# EAGLE design FLC100_shield_v1.0 (EAGLE 6.2)
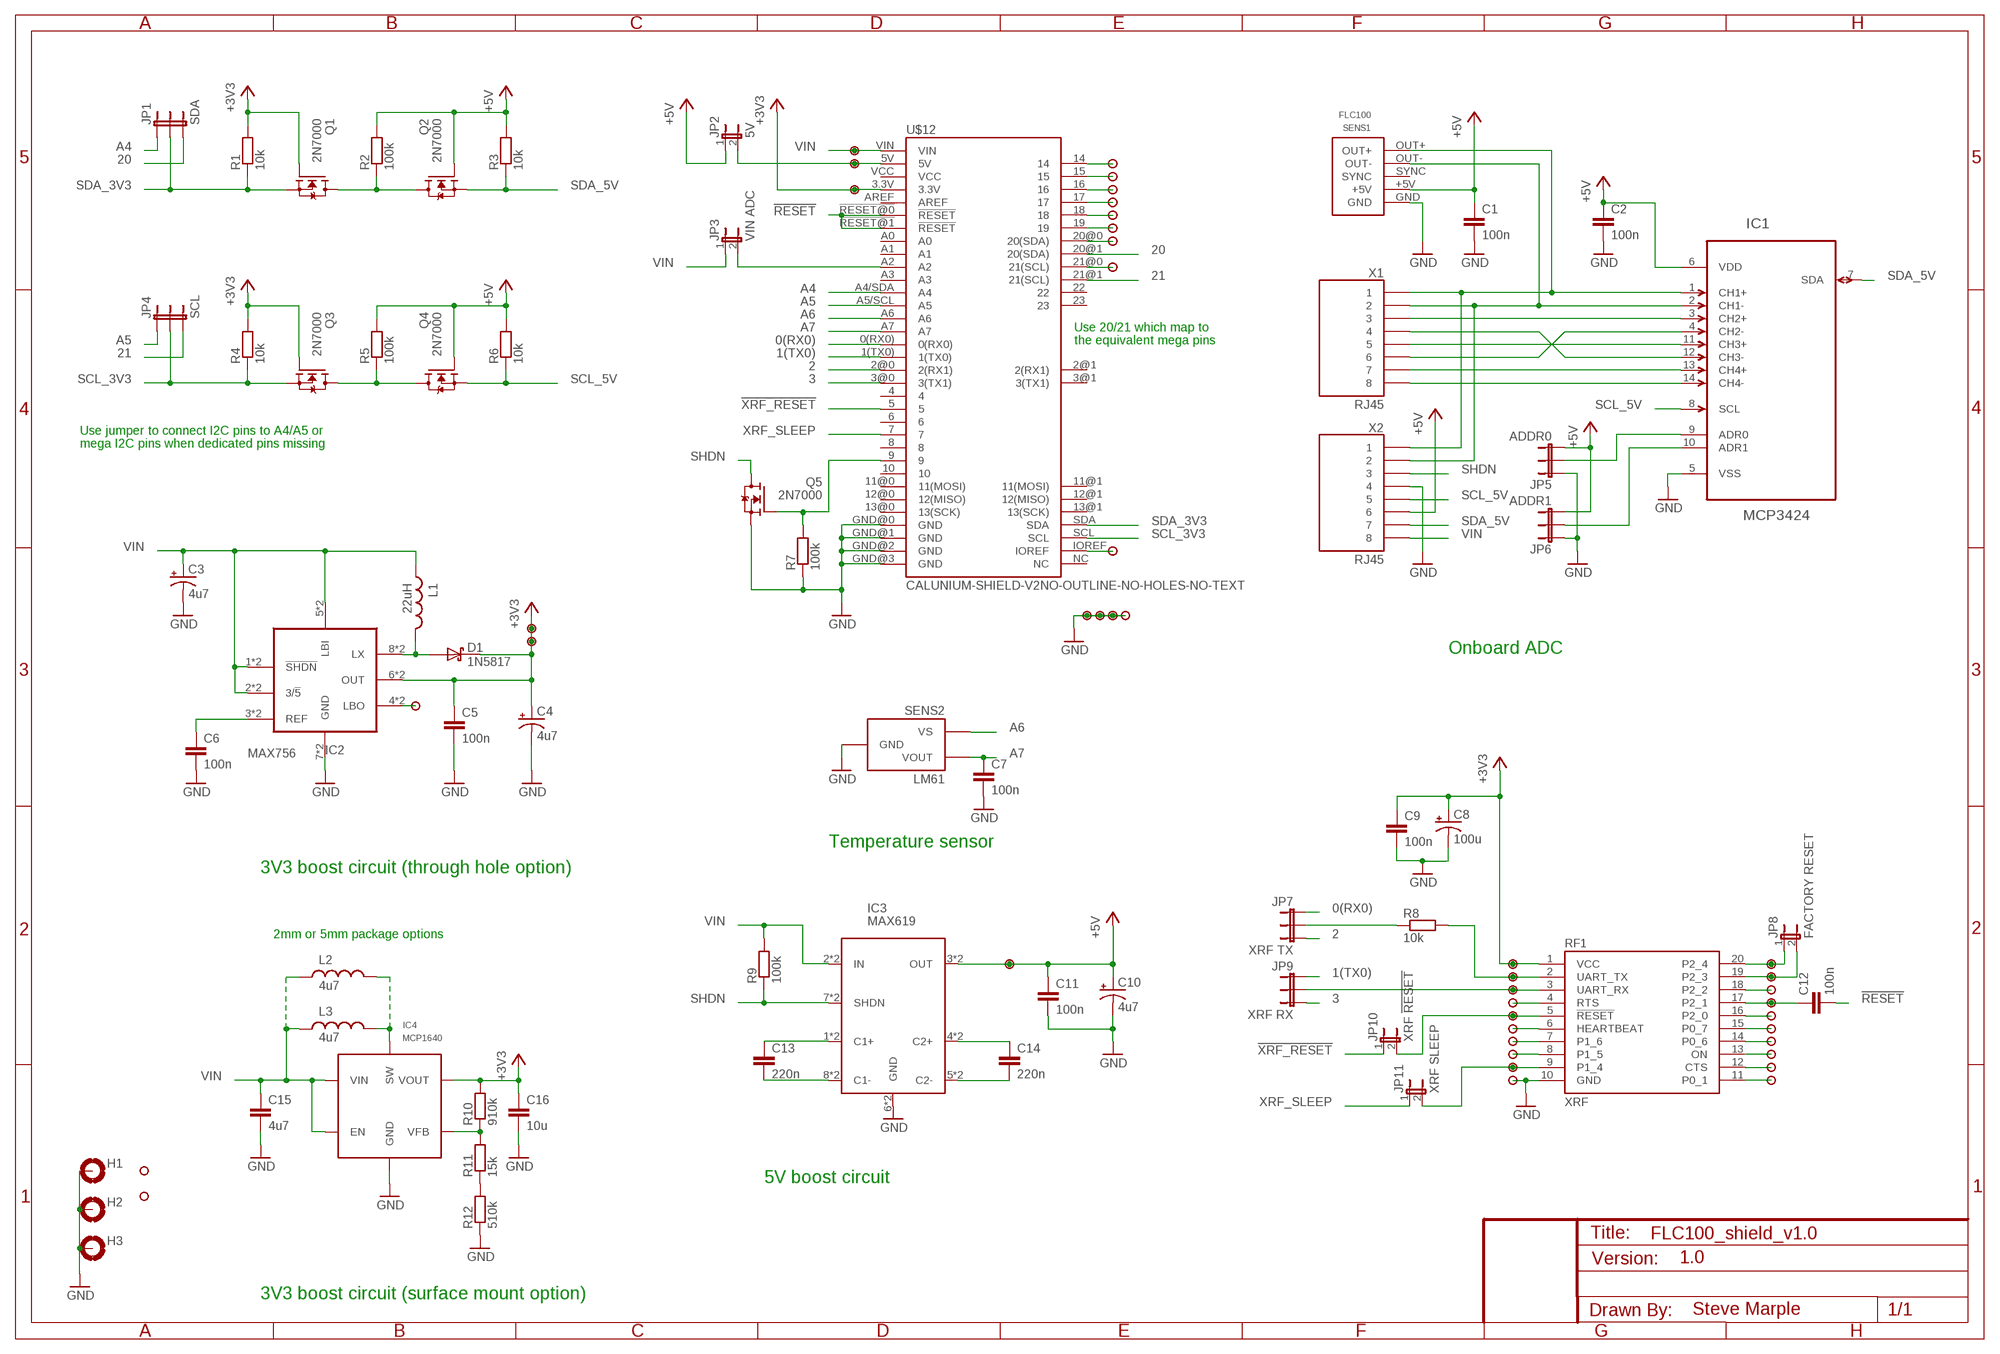
[diagram p0: schematic, sheet 1]

## Parts
C1  100n  CAPPTH  [CAP-PTH-SMALL]
C2  100n  CAPPTH  [CAP-PTH-SMALL]
C3  4u7  CAP_POLPTH2  [CPOL-RADIAL-10UF-25V]
C4  4u7  CAP_POLPTH2  [CPOL-RADIAL-10UF-25V]
C5  100n  CAPPTH  [CAP-PTH-SMALL]
C6  100n  CAPPTH  [CAP-PTH-SMALL]
C7  100n  CAPPTH  [CAP-PTH-SMALL]
C8  100u  CAP_POLPTH2  [CPOL-RADIAL-10UF-25V]
C9  100n  CAPPTH  [CAP-PTH-SMALL]
C10  4u7  CAP_POLPTH2  [CPOL-RADIAL-10UF-25V]
C11  100n  CAPPTH  [CAP-PTH-SMALL]
C12  100n  CAPPTH  [CAP-PTH-SMALL]
C13  220n  CAPPTH1  [CAP-PTH-5MM]
C14  220n  CAPPTH1  [CAP-PTH-5MM]
C15  4u7  C-EU1206-HAND  [1206-HAND]
C16  10u  C-EU1206-HAND  [1206-HAND]
D1  1N5817  DIODE-SCHOTTKY  [DIODE-TH-0.4]
H1  MOUNT-PAD-ROUND3.0  [3,0-PAD]
H2  MOUNT-PAD-ROUND3.0  [3,0-PAD]
H3  MOUNT-PAD-ROUND3.0  [3,0-PAD]
IC1  MCP3424  MCP3424-E/SL  [SOIC127P600X175-14N]
IC2  MAX756  MAX756CPA/CSA  [DIL08-SOIC8]
IC3  MAX619  MAX619DIL08/SOIC8  [DIL08-SOIC8]
IC4  MCP1640  [SOT23-6]
JP1  SDA  JUMPER-3PTH  [1X03]
JP2  5V  JUMPER-2PTH  [1X02]
JP3  VIN ADC  JUMPER-2PTH  [1X02]
JP4  SCL  JUMPER-3PTH  [1X03]
JP5  ADDR0  JUMPER-3PTH  [1X03]
JP6  ADDR1  JUMPER-3PTH  [1X03]
JP7  XRF TX  JUMPER-3PTH  [1X03]
JP8  FACTORY RESET  JUMPER-2PTH  [1X02]
JP9  XRF RX  JUMPER-3PTH  [1X03]
JP10  XRF !RESET  JUMPER-2PTH  [1X02]
JP11  XRF SLEEP  JUMPER-2PTH  [1X02]
L1  22uH  INDUCTORTH-5MM  [INDUCTOR-TH-5MM]
L2  4u7  INDUCTORTH-2MM  [INDUCTOR-TH-2MM]
L3  4u7  INDUCTORTH-5MM  [INDUCTOR-TH-5MM]
Q1  2N7000  [TO-92]
Q2  2N7000  [TO-92]
Q3  2N7000  [TO-92]
Q4  2N7000  [TO-92]
Q5  2N7000  [TO-92]
R1  10k  RESISTOR  [RES-AXIAL-0.4]
R2  100k  RESISTOR  [RES-AXIAL-0.4]
R3  10k  RESISTOR  [RES-AXIAL-0.4]
R4  10k  RESISTOR  [RES-AXIAL-0.4]
R5  100k  RESISTOR  [RES-AXIAL-0.4]
R6  10k  RESISTOR  [RES-AXIAL-0.4]
R7  100k  RESISTOR  [RES-AXIAL-0.4]
R8  10k  RESISTOR  [RES-AXIAL-0.4]
R9  100k  RESISTOR  [RES-AXIAL-0.4]
R10  910k  RESISTOR1206-HAND  [1206-HAND]
R11  15k  RESISTOR1206-HAND  [1206-HAND]
R12  510k  RESISTOR1206-HAND  [1206-HAND]
RF1  XRF  XRFB1  [XBEE]
SENS1  FLC100  [FLC100]
SENS2  LM61  [TO-92]
U$1  PAD  [PAD]
U$2  PAD  [PAD]
U$3  PAD  [PAD]
U$4  PAD  [PAD]
U$5  PAD  [PAD]
U$6  PAD  [PAD]
U$7  PAD  [PAD]
U$8  PAD  [PAD]
U$9  PAD  [PAD]
U$10  PAD  [PAD]
U$11  PAD  [PAD]
U$12  CALUNIUM-SHIELD-V2NO-OUTLINE-NO-HOLES-NO-TEXT  [CALUNIUM-SHIELD-NO-OUTLINE-NO-HOLES-NO-TEXT-V2]
U$13  PAD  [PAD]
U$14  PAD  [PAD]
U$15  PAD  [PAD]
U$16  PAD  [PAD]
U$17  PAD  [PAD]
U$18  PAD  [PAD]
U$19  PAD  [PAD]
U$20  PAD  [PAD]
U$21  PAD  [PAD]
U$22  PAD  [PAD]
U$23  PAD  [PAD]
U$24  PAD  [PAD]
U$25  PAD  [PAD]
U$26  PAD  [PAD]
U$27  PAD  [PAD]
U$28  PAD  [PAD]
U$29  PAD  [PAD]
U$30  PAD  [PAD]
U$31  PAD  [PAD]
U$32  PAD  [PAD]
U$33  PAD  [PAD]
U$34  PAD  [PAD]
U$35  PAD  [PAD]
U$36  PAD  [PAD]
U$37  PAD  [PAD]
U$38  PAD  [PAD]
U$39  PAD  [PAD]
U$40  PAD  [PAD]
U$41  PAD  [PAD]
U$42  PAD  [PAD]
U$43  PAD  [PAD]
X1  RJ45  RJ45-8PTH  [RJ45-8]
X2  RJ45  RJ45-8PTH  [RJ45-8]

## Nets
0(RX0): JP7.1 U$12.0(RX0)
1(TX0): JP9.1 U$12.1(TX0)
2: JP7.3 U$12.2@0(2(RX1))
3: JP9.3 U$12.3@0(3(TX1))
20: JP1.3 U$12.20@1(20(SDA))
21: JP4.3 U$12.21@1(21(SCL))
!RESET: C12.2 U$12.!RESET@0(!RESET) U$12.!RESET@1(!RESET)
!XRF_RESET: JP10.1 U$12.5
+3V3: C4.1(+) C5.1 C8.1(+) C9.1 C16.1 D1.C IC2.6(OUT) IC2.6@1(OUT) IC4.5(VOUT) Q1.2(G) Q3.2(G) R1.P$2 R4.P$2 R10.2 RF1.1(VCC) U$5.1 U$12.3.3V U$18.1 U$19.1 U$22.1
+5V: C1.1 C2.1 C10.1(+) C11.1 IC1.6(VDD) IC3.3(OUT) IC3.3@1(OUT) JP2.1 JP5.3 JP6.3 Q2.2(G) Q4.2(G) R2.P$2 R3.P$2 R5.P$2 R6.P$2 SENS1.+5V U$21.1 X2.6
A4: JP1.1 U$12.A4/SDA(A4)
A5: JP4.1 U$12.A5/SCL(A5)
A6: SENS2.1(VS) U$12.A6
A7: C7.1 SENS2.2(VOUT) U$12.A7
CHECK1: IC1.9(ADR0) JP5.2
CHECK2: IC1.10(ADR1) JP6.2
GND [power]: C1.2 C2.2 C3.2(-) C4.2(-) C5.2 C6.2 C7.2 C8.2(-) C9.2 C10.2(-) C11.2 C15.2 C16.2 H1.B3,0(MOUNT) H2.B3,0(MOUNT) H3.B3,0(MOUNT) IC1.5(VSS) IC2.7(GND) IC2.7@1(GND) IC3.6(GND) IC3.6@1(GND) IC4.2(GND) JP5.1 JP6.1 Q5.1(S) R7.P$1 R12.1 RF1.10(GND) SENS1.GND SENS2.3(GND) U$12.GND@0(GND) U$12.GND@1(GND) U$12.GND@2(GND) U$12.GND@3(GND) U$14.1 U$15.1 U$16.1 U$17.1 U$40.1 X2.4
N$1: Q1.3(D) Q2.3(D) R2.P$1
N$2: Q3.3(D) Q4.3(D) R5.P$1
N$3: C13.2 IC3.8(C1-) IC3.8@1(C1-)
N$4: C13.1 IC3.1(C1+) IC3.1@1(C1+)
N$5: C14.1 IC3.4(C2+) IC3.4@1(C2+)
N$6: C14.2 IC3.5(C2-) IC3.5@1(C2-)
N$7: JP8.1 RF1.20(P2_4) U$23.1
N$8: JP8.2 RF1.19(P2_3) U$25.1
N$9: R8.P$2 RF1.2(UART_TX) U$24.1
N$10: JP9.2 RF1.3(UART_RX) U$26.1
N$11: RF1.4(RTS) U$28.1
N$12: JP10.2 RF1.5(!RESET) U$30.1
N$13: RF1.6(HEARTBEAT) U$32.1
N$14: RF1.7(P1_6) U$34.1
N$15: RF1.8(P1_5) U$36.1
N$16: JP11.2 RF1.9(P1_4) U$38.1
N$17: RF1.18(P2_2) U$27.1
N$18: C12.1 RF1.17(P2_1) U$29.1
N$19: RF1.16(P2_0) U$31.1
N$20: RF1.15(P0_7) U$33.1
N$21: RF1.14(P0_6) U$35.1
N$22: RF1.13(ON) U$37.1
N$23: RF1.12(CTS) U$39.1
N$24: RF1.11(P0_1) U$41.1
N$25: IC2.4(LBO) IC2.4@1(LBO) U$20.1
N$26: Q5.2(G) R7.P$2 U$12.9
N$27: JP3.2 U$12.A2
N$28: JP7.2 R8.P$1
N$29: JP2.2 U$2.1 U$12.5V
N$30: D1.A IC2.8(LX) IC2.8@1(LX) L1.P$2
N$31: C6.1 IC2.3(REF) IC2.3@1(REF)
N$32: IC1.1(CH1+) SENS1.OUT+ X1.1 X2.1
N$33: IC1.2(CH1-) SENS1.OUT- X1.2 X2.2
N$34: IC1.3(CH2+) X1.3
N$35: IC1.4(CH2-) X1.6
N$36: IC1.11(CH3+) X1.5
N$37: IC1.12(CH3-) X1.4
N$38: IC1.13(CH4+) X1.7
N$39: IC1.14(CH4-) X1.8
N$40: U$11.1 U$12.21@0(21(SCL))
N$41: IC4.1(SW) L2.P$2 L3.P$2
N$42: R11.1 R12.2
N$43: U$3.1 U$12.14
N$44: U$4.1 U$12.15
N$45: U$6.1 U$12.16
N$46: IC4.4(VFB) R10.1 R11.2
N$47: U$7.1 U$12.17
N$48: U$8.1 U$12.18
N$49: U$9.1 U$12.19
N$50: U$10.1 U$12.20@0(20(SDA))
N$52: U$12.IOREF U$13.1
SCL_3V3: JP4.2 Q3.1(S) R4.P$1 U$12.SCL
SCL_5V: IC1.8(SCL) Q4.1(S) R6.P$1 X2.5
SDA_3V3: JP1.2 Q1.1(S) R1.P$1 U$12.SDA
SDA_5V: IC1.7(SDA) Q2.1(S) R3.P$1 X2.7
SHDN: IC3.7(SHDN) IC3.7@1(SHDN) Q5.3(D) R9.P$1 X2.3
VIN [power]: C3.1(+) C15.1 IC2.1(!SHDN) IC2.1@1(!SHDN) IC2.2(3/!5) IC2.2@1(3/!5) IC2.5(LBI) IC2.5@1(LBI) IC3.2(IN) IC3.2@1(IN) IC4.3(EN) IC4.6(VIN) JP3.1 L1.P$1 L2.P$1 L3.P$1 R9.P$2 U$1.1 U$12.VIN X2.8
XRF_SLEEP: JP11.1 U$12.7
Unconnected: SENS1.SYNC U$12.2@1(2(RX1)) U$12.3@1(3(TX1)) U$12.4 U$12.6 U$12.8 U$12.10 U$12.11@0(11(MOSI)) U$12.11@1(11(MOSI)) U$12.12@0(12(MISO)) U$12.12@1(12(MISO)) U$12.13@0(13(SCK)) U$12.13@1(13(SCK)) U$12.22 U$12.23 U$12.A0 U$12.A1 U$12.A3 U$12.AREF U$12.NC U$12.VCC U$42.1 U$43.1

## Notes on the sheet
- Use 20/21 which map to
- the equivalent mega pins
- Use jumper to connect I2C pins to A4/A5 or
- mega I2C pins when dedicated pins missing
- Onboard ADC
- Temperature sensor
- 3V3 boost circuit (through hole option)
- 2mm or 5mm package options
- 5V boost circuit
- 1.0
- 3V3 boost circuit (surface mount option)
- Steve Marple

## Library data of the parts
C1 C2 C5-C7 C9 C11-C14 = SparkFun:CAP: Capacitor Standard 0603 ceramic capacitor, and 0.1" leaded capacitor.
C3 C4 C8 C10 = SparkFun:CAP_POL: Capacitor Polarized These are standard SMD and PTH capacitors. Normally 10uF, 47uF, and 100uF in electrolytic and tantalum varieties. Always verify the external diameter of the through hole cap, it varies with capacity, voltage, and manufacturer. The EIA devices should be standard.
C15 C16 = SteveMarple:C-EU
D1 = SteveMarple:DIODE-SCHOTTKY
H1-H3 = holes:MOUNT-PAD-ROUND: MOUNTING PAD, round
IC1 = SteveMarple:MCP3424-E/SL: Analog-to-Digital Converter Eagle file download from Onecall web site; MPN: MCP3424-E/SL; OC_FARNELL: 1630424; OC_NEWARK: 54M4871; PACKAGE: SOIC-14; SUPPLIER: Microchip
IC2 = SteveMarple:MAX756: 3V3/5V step-up (boost) DC-DC converter.
IC3 = SteveMarple:MAX619: Regulated 5V charge pump DC-DC converter
IC4 = SteveMarple:MCP1640: MCP1640 0.65V Start-up Synchronous Boost Regulator with True Output Disconnect or Input/Output Bypass Option
JP1 JP4-JP7 JP9 = SparkFun:JUMPER-3
JP2 JP3 JP8 JP10 JP11 = SparkFun:JUMPER-2: Jumper Basic 0.1" spaced jumper. Use with breakaway headers.
L1-L3 = SteveMarple:INDUCTOR: Inductors Basic Inductor/Choke - 0603 and 1206. Footprints are not proven and vary greatly between part numbers.
Q1-Q5 = SteveMarple:2N7000: 2N7000 FET
R1-R12 = SteveMarple:RESISTOR: 1/4W PTH resistor
RF1 = SteveMarple:XRF
SENS1 = SteveMarple:FLC100: Stefan Mayer Instruments FLC100 fluxgate magnetometer sensor
SENS2 = SteveMarple:LM61
U$1-U$11 U$13-U$43 = SteveMarple:PAD
U$12 = SteveMarple:CALUNIUM-SHIELD-V2
X1 X2 = SteveMarple:RJ45-8: RJ45 Jack Simple RJ45, 8-pin connection - connector for common Cat5, Cat5e, and Cat6 Ethernet cables. Footprint not yet proven in production. Connector sku is PRT-00643; Breakout PCB sku is BOB-00716.

## Net classes
1 power: width 0.406 mm

## Board
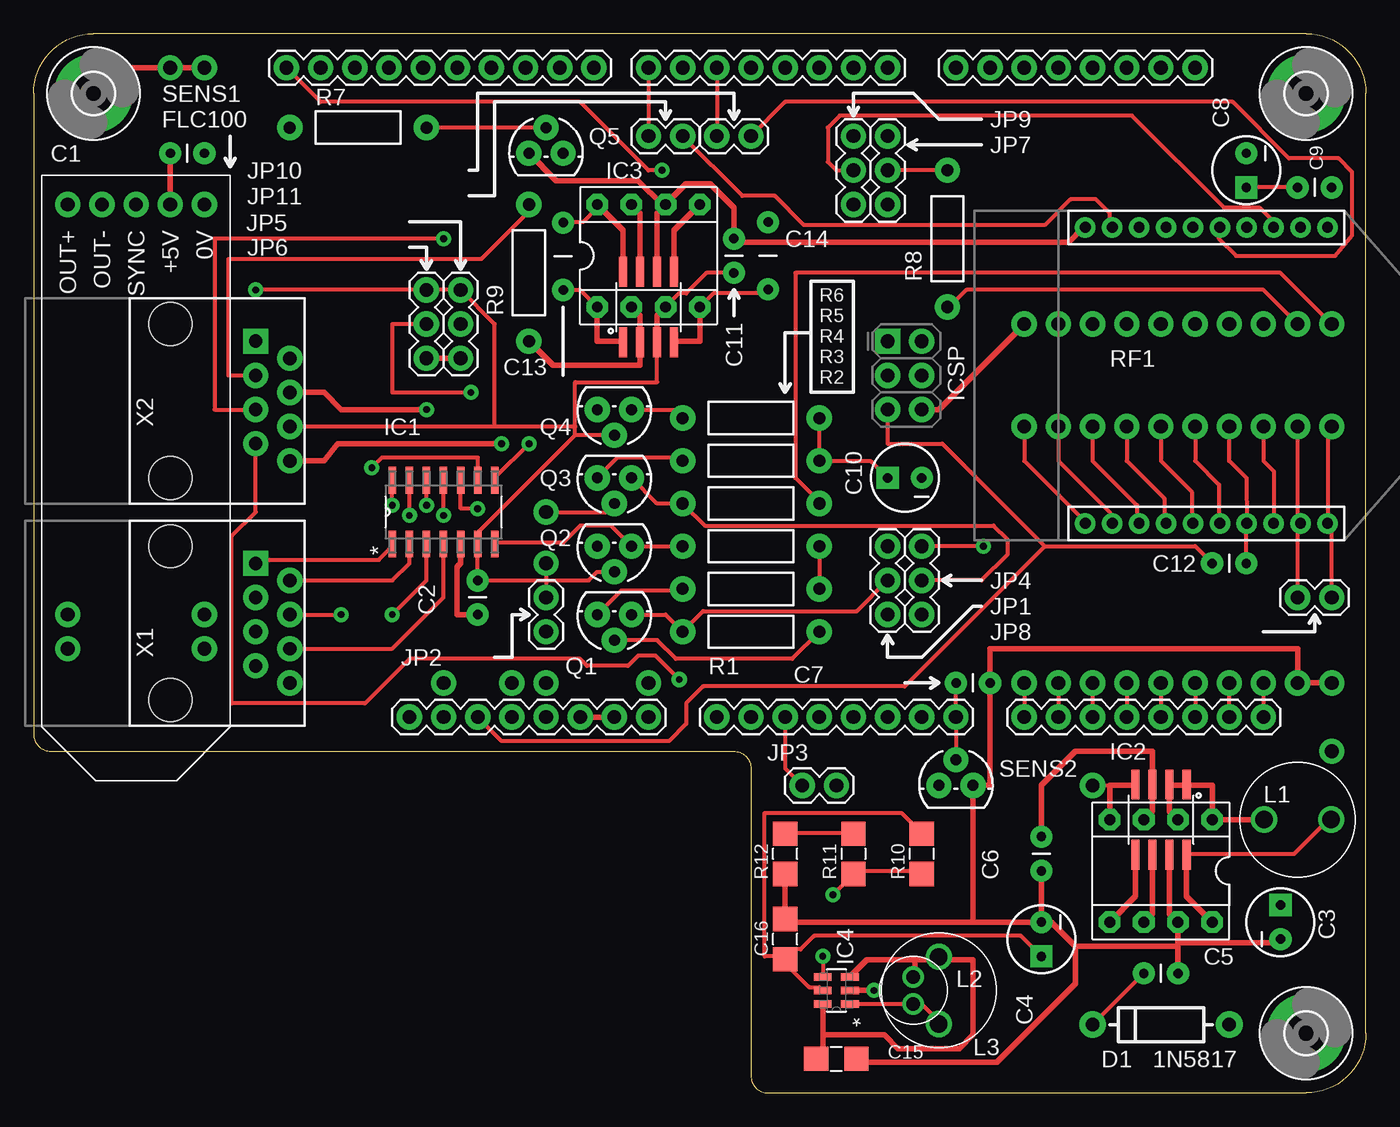
[diagram p1: board, top side]
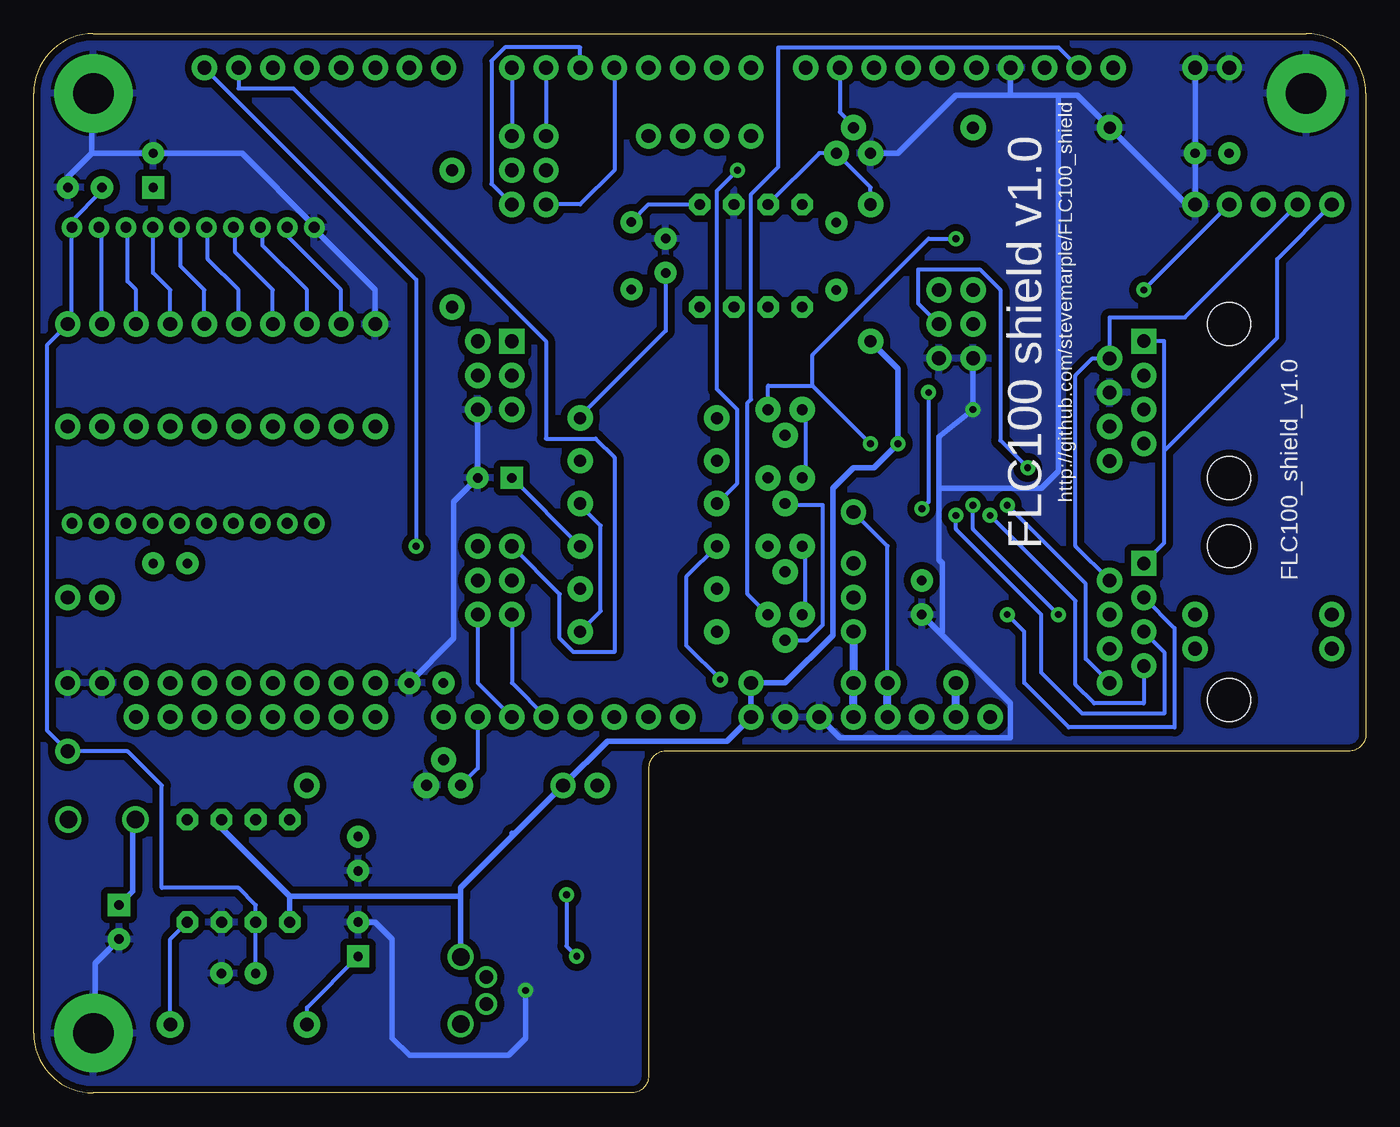
[diagram p2: board, bottom side, seen from below]

Size 99.06 x 78.74 mm. Coordinates in mm from the lower left corner, seen from the top.
Outline: 54.61,0 94.61,0 arc90 99.06,4.45 99.06,74.3 arc90 94.61,78.74 4.45,78.74 arc90 0,74.3 0,26.67 arc90 1.27,25.4 52.07,25.4 arc-90 53.34,24.13 53.34,1.27 arc90 54.61,0
Copper layers (1*16): Top 0.035mm / dielectric 1.5mm / Bottom 0.035mm
Design rules: minimum track width 12mil, minimum drill 20mil, track to track 12mil, track to pad 12mil, pad to pad 12mil, via to via 12mil, smd to smd 12mil, copper to edge 0.5mm, drill to drill 8mil, minimum pad ring 12mil, minimum via ring 12mil, stop-mask expansion 4mil, vias tented up to drill 25mil, thermal gap 10mil

### Footprints (pad centres in the part's own frame; a part is rotated, then mirrored left to right if it is on the bottom)
CAP-PTH-SMALL = drill 0.7 pad 1.651: 1 0,0; 2 2.54,0
CPOL-RADIAL-10UF-25V = drill 0.7 pad 1.651 square: 1 1.27,0 | drill 0.7 pad 1.651: 2 -1.27,0
CAP-PTH-5MM = drill 0.7 pad 1.651: 1 -2.5,0; 2 2.5,0
1206-HAND = smd 1.8 x 1.803: 1 -1.499,0; 2 1.499,0
DIODE-TH-0.4 = drill 1 pad 1.981: A -5.08,0; C 5.08,0
3,0-PAD = drill 3 pad 5.842: B3,0 0,0
SOIC127P600X175-14N = smd 1.981 x 0.559: 1 -2.362,3.81; 2 -2.362,2.54; 3 -2.362,1.27; 4 -2.362,0; 5 -2.362,-1.27; 6 -2.362,-2.54; 7 -2.362,-3.81; 8 2.362,-3.81; 9 2.362,-2.54; 10 2.362,-1.27; 11 2.362,0; 12 2.362,1.27; 13 2.362,2.54; 14 2.362,3.81
DIL08-SOIC8 = drill 0.813 pad 1.6 octagon: 1 -3.81,-3.81; 2 -1.27,-3.81; 3 1.27,-3.81; 4 3.81,-3.81; 5 3.81,3.81; 6 1.27,3.81; 7 -1.27,3.81; 8 -3.81,3.81 | smd 0.61 x 2.21: 1@1 -1.905,-6.426; 2@1 -0.635,-6.426; 3@1 0.635,-6.426; 4@1 1.905,-6.426; 5@1 1.905,-1.194; 6@1 0.635,-1.194; 7@1 -0.635,-1.194; 8@1 -1.905,-1.194
SOT23-6 = smd 1.321 x 0.559: 1 -1.016,1.016; 2 -1.016,0; 3 -1.016,-1.016; 4 1.016,-1.016; 5 1.016,0; 6 1.016,1.016
1X03 = drill 1.016 pad 1.88: 1 0,0; 2 2.54,0; 3 5.08,0
1X02 = drill 1.016 pad 1.88: 1 0,0; 2 2.54,0
INDUCTOR-TH-5MM = drill 1.3: P$1 -2.5,0; P$2 2.5,0
INDUCTOR-TH-2MM = drill 1: P$1 -1,0; P$2 1,0
TO-92 = drill 0.813 pad 1.88: 1 -1.27,0; 2 0,1.905; 3 1.27,0
RES-AXIAL-0.4 = drill 0.9 pad 1.88: P$1 -5.08,0; P$2 5.08,0
XBEE = drill 0.8 pad 1.524: 1 -11,20; 2 -11,18; 3 -11,16; 4 -11,14; 5 -11,12; 6 -11,10; 7 -11,8; 8 -11,6; 9 -11,4; 10 -11,2; 11 11,2; 12 11,4; 13 11,6; 14 11,8; 15 11,10; 16 11,12; 17 11,14; 18 11,16; 19 11,18; 20 11,20
FLC100 = drill 1.016 pad 1.88: +5V -20.32,2.54; GND -20.32,5.08; NC@0 12.7,5.08; NC@1 12.7,-5.08; OUT+ -20.32,-5.08; OUT- -20.32,-2.54; SYNC -20.32,0
PAD = drill 1.016 pad 1.88: 1 0,0
CALUNIUM-SHIELD-NO-OUTLINE-NO-HOLES-NO-TEXT-V2 = drill 1.016 pad 1.88: 0(RX0) 0,21.59; 1(TX0) -2.54,21.59; 2@0 -5.08,21.59; 2@1 17.78,21.59; 3.3V -27.94,-26.67; 3@0 -7.62,21.59; 3@1 15.24,21.59; 4 -10.16,21.59; 5 -12.7,21.59; 5V -25.4,-26.67; 6 -15.24,21.59; 7 -17.78,21.59; 8 -21.844,21.59; 9 -24.384,21.59; 10 -26.924,21.59; 11@0 -29.464,21.59; 11@1 2.54,-1.27; 12@0 -32.004,21.59; 13@0 -34.544,21.59; 13@1 0,-1.27; 14 10.16,-26.67; 15 12.7,-26.67; 16 15.24,-26.67; 17 17.78,-26.67; 18 20.32,-26.67; 19 22.86,-26.67; 20@0 25.4,-26.67; 20@1 20.32,21.59; 21@0 27.94,-26.67; 21@1 22.86,21.59; 22 5.08,21.59; 23 7.62,21.59; !RESET@0 -30.48,-26.67; !RESET@1 0,-3.81; A0 -12.7,-26.67; A1 -10.16,-26.67; A2 -7.62,-26.67; A3 -5.08,-26.67; A4/SDA -2.54,-26.67; A5/SCL 0,-26.67; A6 2.54,-26.67; A7 5.08,-26.67; AREF -39.624,21.59; GND@0 -22.86,-26.67; GND@1 -20.32,-26.67; GND@2 -37.084,21.59; GND@3 2.54,-3.81; IOREF -33.02,-26.67; NC -35.56,-26.67; NC@0 12.7,21.59; NC@1 10.16,21.59; SCL -44.704,21.59; SDA -42.164,21.59; VCC 2.54,1.27; VIN -17.78,-26.67 | drill 1.016 pad 1.88 square: 12@1 0,1.27
RJ45-8 = drill 1 pad 1.88 square: 1 -4.445,6.35 | drill 1 pad 1.88: 2 -3.175,8.89; 3 -1.905,6.35; 4 -0.635,8.89; 5 0.635,6.35; 6 1.905,8.89; 7 3.175,6.35; 8 4.445,8.89 | hole 3.2: -5.715,0; 5.715,0

### Placement (x,y rotation side)
C1  10.16,69.85 0 top
C2  33.02,38.1 270 top
C3  92.71,12.7 90 top
C4  74.93,11.43 270 top
C5  82.55,8.89 0 top
C6  74.93,19.05 270 top
C7  68.58,30.48 0 top
C8  90.17,68.58 270 top
C9  93.98,67.31 0 top
C10  64.77,45.72 180 top
C11  52.07,60.96 90 top
C12  90.17,39.37 180 top
C13  39.37,62.19 90 top
C14  54.61,62.23 90 top
C15  59.69,2.54 0 top
C16  55.88,11.43 90 top
D1  83.82,5.08 180 top
H1  4.45,74.3 0 top
H2  94.61,4.45 0 top
H3  94.61,74.3 0 top
IC1  30.48,43.18 90 top
IC2  83.82,16.51 180 top
IC3  45.72,62.23 0 top
IC4  59.69,7.62 180 top
JP1  63.5,35.56 90 top
JP2  38.1,36.83 270 top
JP3  59.69,22.86 180 top
JP4  66.04,35.56 90 top
JP5  31.75,54.61 90 top
JP6  29.21,54.61 90 top
JP7  63.5,71.12 270 top
JP8  96.52,36.83 180 top
JP9  60.96,71.12 270 top
JP10  50.8,71.12 0 top
JP11  45.72,71.12 0 top
L1  93.98,20.32 0 top
L2  65.41,7.62 270 top
L3  67.31,7.62 270 top
Q1  43.18,35.56 180 top
Q2  43.18,40.64 180 top
Q3  43.18,45.72 180 top
Q4  43.18,50.8 180 top
Q5  38.1,69.85 0 top
R1  53.34,34.29 0 top
R2  53.34,37.47 0 top
R3  53.34,40.64 0 top
R4  53.34,43.81 0 top
R5  53.34,46.99 0 top
R6  53.34,50.16 0 top
R7  24.13,71.75 0 top
R8  67.94,63.5 270 top
R9  36.83,60.96 270 top
R10  66.04,17.78 90 top
R11  60.96,17.78 270 top
R12  55.88,17.78 90 top
RF1  76.2,53.34 270 top
SENS1  7.62,45.72 270 top
SENS2  68.58,22.86 0 top
U$1  45.72,30.48 0 top
U$2  38.1,30.48 0 top
U$3  73.66,30.48 90 top
U$4  76.2,30.48 90 top
U$5  35.56,30.48 0 top
U$6  78.74,30.48 90 top
U$7  81.28,30.48 90 top
U$8  83.82,30.48 90 top
U$9  86.36,30.48 90 top
U$10  88.9,30.48 0 top
U$11  91.44,30.48 0 top
U$12  63.5,54.61 0 top
U$13  30.48,30.48 0 top
U$14  10.16,76.2 0 top
U$15  12.7,76.2 0 top
U$16  93.98,30.48 0 top
U$17  96.52,30.48 0 top
U$18  96.52,25.4 0 top
U$19  38.1,43.18 0 top
U$20  78.74,22.86 0 top
U$21  38.1,39.37 0 top
U$22  96.52,57.15 0 top
U$23  96.52,49.53 0 top
U$24  93.98,57.15 270 top
U$25  93.98,49.53 0 top
U$26  91.44,57.15 270 top
U$27  91.44,49.53 270 top
U$28  88.9,57.15 270 top
U$29  88.9,49.53 270 top
U$30  86.36,57.15 270 top
U$31  86.36,49.53 270 top
U$32  83.82,57.15 270 top
U$33  83.82,49.53 270 top
U$34  81.28,57.15 270 top
U$35  81.28,49.53 270 top
U$36  78.74,57.15 270 top
U$37  78.74,49.53 270 top
U$38  76.2,57.15 270 top
U$39  76.2,49.53 270 top
U$40  73.66,57.15 0 top
U$41  73.66,49.53 270 top
U$42  12.7,35.56 0 top
U$43  2.54,35.56 0 top
X1  10.16,34.92 270 top
X2  10.16,51.44 270 top

### Tracks (layer width: path | path; a pad name or v marks a point on that pad's centre or on a via)
0(RX0)
  Bottom 0.305: U$12.0(RX0) JP7.1
1(TX0)
  Bottom 0.305: U$12.1(TX0) JP9.1
2
  Bottom 0.305: JP7.3 65.02,67.56 65.02,76.71 64.01,77.72 58.42,77.72 U$12.2@0
3
  Bottom 0.305: JP9.3 58.42,66.04 55.88,68.58 U$12.3@0
20
  Bottom 0.305: JP1.3 59.94,37.08 59.94,33.78 58.93,32.77 55.88,32.77 55.88,47.24 57.28,48.64 60.96,48.64 60.96,55.88 79.76,74.68 83.82,74.68 U$12.20@1
21  (via drill 0.51)
  Top 0.305: v70.61,40.64 JP4.3
  Bottom 0.305: v70.61,40.64 70.61,60.45 U$12.21@1
!RESET
  Top 0.305: C12.2 86.36,40.64 75.18,40.64 | U$12.!RESET@1 63.5,48.26 67.56,48.26 75.18,40.64 | U$12.!RESET@0 34.8,26.16 47.24,26.16 48.51,27.43 48.51,28.96 49.78,30.23 64.77,30.23 75.18,40.64
!XRF_RESET
  Top 0.305: U$12.5 JP10.1
+3V3
  Top 0.305: R1.P$2 56.39,32.26 47.75,32.26 46.35,33.66 Q1.2 | IC4.5 58.42,7.87 57.66,7.87 55.88,9.65 C16.1 55.88,10.16 | 55.88,10.16 54.36,10.16 54.36,20.83 64.52,20.83 66.04,19.3 R10.2 | C9.1 C8.1 | D1.C C5.1 | 55.88,10.16 56.39,10.67 57.02,10.67 58.04,11.68 73.41,11.68 C4.1 | U$22.1 92.71,60.96 56.64,60.96 56.64,45.72 58.42,43.94 R4.P$2 | U$19.1 42.55,43.18 Q3.2 | IC2.6@1 83.19,13.34
  Bottom 0.305: Q1.2 41.53,33.66 40.39,34.8 40.39,43.69 43.18,43.69 Q3.2 | R1.P$2 56.9,35.81 56.9,42.16 58.42,43.69 R4.P$2 | 96.27,64.77 93.98,67.06 C9.1 | 96.27,64.77 96.27,57.4 U$22.1 98.04,55.63 98.04,26.92 U$18.1 92.08,25.4 89.53,22.86 89.53,15.24 83.82,15.24 82.55,13.97 IC2.6 C5.1 | 96.27,64.77 RF1.1 | C4.1 78.74,6.35 D1.C | U$5.1 35.56,40.64 U$19.1
  Bottom 0.61: U$12.3.3V U$5.1
+5V  (via drill 0.51)
  Top 0.305: v16.51,59.69 JP6.3 JP5.3 34.29,57.15 34.29,49.53 | R3.P$2 R2.P$2 | C10.1 62.23,46.99 R5.P$2 R6.P$2 | 46.35,55.88 46.48,55.88 IC3.3@1 46.35,52.83 40.26,52.83 40.26,49.53 | IC3.3 48.01,59.44 48.51,59.44 50.04,60.96 C11.1 | 38.1,38.1 41.27,38.1 41.91,38.73 Q2.2 | 40.26,48.9 33.02,41.66 IC1.6 C2.1 38.1,38.1 | Q4.2 40.26,48.9 | 40.26,48.9 40.26,49.53 | 40.26,49.53 34.29,49.53 | 34.29,49.53 X2.6 | U$21.1 38.1,38.1 | 38.1,38.1 JP2.1
  Top 0.406: SENS1.+5V C1.1
  Bottom 0.305: v16.51,59.69 SENS1.+5V | C10.1 R3.P$2 | C11.1 52.07,56.64 58.42,50.29 R6.P$2
A4
  Bottom 0.305: U$12.A4/SDA 63.5,30.48 JP1.1
A5
  Bottom 0.305: U$12.A5/SCL 66.04,30.48 JP4.1
A6
  Bottom 0.305: SENS2.1 66.04,24.13 U$12.A6
A7
  Top 0.305: C7.1 U$12.A7 SENS2.2
CHECK1  (via drill 0.51)
  Top 0.305: IC1.9 33.02,47.24 25.91,47.24 v25.15,46.48
  Bottom 0.305: v25.15,46.48 27.18,48.51 27.18,59.69 28.7,61.21 33.27,61.21 33.27,58.67 JP5.2
CHECK2  (via drill 0.51)
  Top 0.305: IC1.10 31.75,43.43 v33.02,43.43 | v32.51,52.07 26.67,52.07 26.67,57.15 JP6.2
  Bottom 0.305: v33.02,43.43 32.51,43.94 v32.51,52.07
GND  (via drill 0.51)
  Top 0.406: v29.21,50.8 22.86,50.8 21.59,52.07 X2.4 | JP6.1 JP5.1 | U$12.GND@1 U$12.GND@0 | IC1.5 31.75,39.37 31.5,39.12 31.5,35.56 C2.2 | 46.35,61.21 IC3.6@1 46.35,60.96 | Q5.1 38.86,67.82 44.96,67.82 46.74,66.04 IC3.6 48.51,67.56 50.29,67.56 52.07,65.79 C11.2 52.32,63.25 76.96,63.25 77.98,64.26 RF1.10 78.23,64.26 | U$40.1 67.31,50.8 U$12.GND@3 | C5.2 85.09,10.92 | 85.09,10.92 85.09,11.18 | 85.09,11.18 IC2.7 | R12.1 C16.2 55.88,12.7 69.85,12.7 | v62.48,7.62 IC4.2 | 77.47,10.92 75.69,12.7 C4.2 | 77.47,10.92 77.47,8.13 71.63,2.29 61.72,2.29 60.96,2.54 61.47,2.79 61.21,2.54 C15.2 | C4.2 69.85,12.7 | C4.2 C6.2 | 77.47,10.92 85.09,10.92 | 69.85,12.7 SENS2.3 71.12,22.86 C7.2 71.12,33.02 93.98,33.02 U$16.1 U$17.1 | C3.2 92.46,11.18 85.09,11.18 | U$15.1 U$14.1 6.35,76.2 H1.B3,0 | IC2.7@1 84.45,13.34
  Bottom 0.406: JP6.1 v29.21,50.8 31.75,48.77 31.75,44.96 | U$12.GND@0 39.12,26.42 26.42,26.42 26.42,28.96 31.62,34.16 | C2.2 31.62,34.16 | 31.75,44.96 31.75,39.62 31.5,39.37 31.5,34.29 31.62,34.16 | 26.42,74.17 30.48,74.17 34.8,69.85 Q5.1 | 26.42,74.17 22.86,74.17 | U$12.GND@2 26.42,74.17 | 31.75,44.96 24.13,44.96 22.86,46.23 22.86,74.17 | 94.74,69.85 96.52,68.07 C9.2 | 94.74,69.85 94.74,74.17 H3.B3,0 | 94.74,69.85 C8.2 83.57,69.85 78.23,64.52 RF1.10 77.98,64.01 73.66,59.69 U$40.1 | U$12.GND@3 C10.2 67.82,43.94 67.82,33.78 C7.2 | C3.2 94.49,9.65 94.49,4.57 H2.B3,0 | v62.48,7.62 62.48,4.06 63.75,2.79 71.12,2.79 72.39,4.06 72.39,11.43 73.66,12.7 C4.2 | 22.86,74.17 21.46,74.17 R7.P$1 13.34,66.04 SENS1.GND C1.2 U$15.1
  pour Bottom (isolate 0.508): -1.27,-1.27 -1.27,80.01 100.33,80.01 100.33,-1.27
N$1
  Top 0.305: Q1.3 43.69,37.34 48.26,37.34 R2.P$1
  Bottom 0.305: Q2.3 41.66,40.39 41.66,35.81 Q1.3
N$2
  Top 0.305: R5.P$1 48.01,47.24 43.43,47.24 Q3.3
  Bottom 0.305: Q3.3 41.66,45.97 41.66,50.55 Q4.3
N$3
  Top 0.305: IC3.8@1 43.94,61.21 43.81,60.96 | IC3.8 41.91,65.79 40.89,64.77 39.37,64.77 C13.2
N$4
  Top 0.305: IC3.1@1 43.94,55.88 41.91,55.88 | IC3.1 40.64,59.69 C13.1
N$5
  Top 0.305: IC3.4@1 47.75,55.88 47.62,55.88 | IC3.4 50.55,59.44 54.36,59.44 54.61,59.69 C14.1
N$6
  Top 0.305: IC3.5@1 47.75,61.21 47.62,60.96
  Bottom 0.305: IC3.5 53.34,66.04 54.61,64.77 C14.2
N$7
  Top 0.305: JP8.1 96.52,41.91 96.27,42.16 RF1.20 96.27,42.42 96.27,49.28 U$23.1
N$8
  Top 0.305: JP8.2 93.98,42.16 RF1.19 93.98,42.42 U$25.1
N$9
  Top 0.305: U$24.1 91.44,59.69 69.34,59.69 68.07,58.42 R8.P$2
  Bottom 0.305: U$24.1 93.98,64.26 RF1.2
N$10
  Top 0.305: JP9.2 59.69,68.58 59.05,69.22 59.05,71.75 59.94,72.64 81.66,72.64 88.52,65.79 91.19,65.79 92.2,64.77 RF1.3
  Bottom 0.305: U$26.1 91.44,59.69 92.08,60.33 92.08,64.14 92.2,64.26 RF1.3
N$11
  Bottom 0.305: U$28.1 88.9,59.69 90.17,60.96 90.17,64.26 RF1.4
N$12
  Top 0.305: JP10.2 55.88,73.66 89.15,73.66 93.34,69.47 97.03,69.47 98.04,68.45 98.04,63.75 96.77,62.23 89.41,62.23 88.14,63.5 RF1.5
  Bottom 0.305: U$30.1 86.36,59.69 88.14,61.47 88.14,64.26 RF1.5
N$13
  Bottom 0.305: U$32.1 83.82,59.69 86.11,61.98 86.11,64.14 RF1.6
N$14
  Bottom 0.305: U$34.1 81.28,59.69 84.07,62.48 84.07,64.01 RF1.7
N$15
  Bottom 0.305: U$36.1 78.74,59.69 82.04,62.99 82.04,64.01 RF1.8
N$16
  Top 0.305: JP11.2 52.7,66.67 55.12,66.67 57.28,64.52 75.18,64.52 77.09,66.42 78.99,66.42 80.01,65.41 80.01,64.52 RF1.9
  Bottom 0.305: U$38.1 76.2,59.69 80.26,63.75 RF1.9
N$17
  Top 0.305: U$27.1 91.44,46.99 92.2,46.23 RF1.18
N$18
  Top 0.305: C12.1 90.17,42.16 RF1.17 90.17,45.72 88.9,46.99 U$29.1
N$19
  Top 0.305: U$31.1 86.36,46.99 88.14,45.21 88.14,42.67 RF1.16
N$20
  Top 0.305: U$33.1 83.82,46.99 86.11,44.7 86.11,42.42 RF1.15
N$21
  Top 0.305: U$35.1 81.28,46.99 84.07,44.2 84.07,42.67 RF1.14
N$22
  Top 0.305: U$37.1 78.74,46.99 82.04,43.69 82.04,42.67 RF1.13
N$23
  Top 0.305: U$39.1 76.2,46.99 80.01,43.18 80.01,42.55 RF1.12
N$24
  Top 0.305: 77.98,42.67 73.66,46.99 U$41.1 | 77.98,42.67 78.11,42.55 | 77.98,42.67 77.98,42.42 RF1.11
N$25
  Top 0.305: IC2.4@1 82.04,22.86 80.01,22.86 U$20.1
N$26
  Top 0.305: Q5.2 R7.P$2
  Bottom 0.305: U$12.9 39.12,72.9 38.1,71.88 Q5.2
N$27
  Top 0.305: JP3.2 55.88,24.13 U$12.A2
N$28
  Top 0.305: R8.P$1 JP7.2
N$29
  Bottom 0.61: JP2.2 U$2.1 U$12.5V
N$30
  Top 0.305: L1.P$2 96.27,20.32 93.73,17.78 85.85,17.78 IC2.8@1 | 85.85,17.53 IC2.8@1 | IC2.8@1 85.72,14.61
  Bottom 0.305: IC2.8 88.9,11.43 D1.A
N$31
  Top 0.305: 83.31,22.86 IC2.3@1 83.31,23.11 83.19,23.11
  Top 0.406: C6.1 74.93,22.86 77.47,25.4 83.19,25.4 83.19,23.11 IC2.3@1 83.19,22.86
N$32
  Top 0.305: X1.1 16.76,39.62 25.65,39.62 26.67,40.64 IC1.1
  Bottom 0.305: X2.1 14.99,55.88 14.99,47.75 | 14.99,47.75 14.99,40.89 X1.1 | SENS1.OUT+ 6.6,61.98 6.6,56.13 14.99,47.75
N$33
  Top 0.305: IC1.2 27.94,39.37 26.67,38.1 X1.2
  Bottom 0.305: X1.2 21.59,40.64 21.59,53.34 20.32,54.61 X2.2 19.05,57.66 13.46,57.66 SENS1.OUT-
N$34  (via drill 0.51)
  Top 0.305: v26.67,35.56 29.21,38.1 IC1.3
  Bottom 0.305: v26.67,35.56 25.4,34.29 25.4,30.48 22.1,27.18 14.22,27.18 14.22,34.54 X1.3
N$35
  Top 0.305: IC1.4 30.48,36.83 26.67,33.02 X1.6
N$36  (via drill 0.51)
  Top 0.305: v30.48,42.93 IC1.11
  Bottom 0.305: v30.48,42.93 30.48,41.91 24.13,35.56 24.13,31.24 21.08,28.19 14.99,28.19 14.99,32.77 X1.5
N$37  (via drill 0.51)
  Top 0.305: v29.21,43.69 IC1.12 | X1.4 v22.86,35.56
  Bottom 0.305: v29.21,43.69 29.21,41.91 v22.86,35.56
N$38  (via drill 0.51)
  Top 0.305: v27.94,42.93 IC1.13
  Bottom 0.305: v27.94,42.93 21.59,36.58 21.59,30.35 20.19,28.96 16.51,28.96 X1.7
N$39  (via drill 0.51)
  Top 0.305: v26.67,43.69 IC1.14
  Bottom 0.305: v26.67,43.69 20.83,37.85 20.83,32.26 X1.8
N$40
  Top 0.305: U$11.1 U$12.21@0
N$41
  Top 0.305: IC4.1 65.28,6.6 L2.P$2 65.53,6.6 66.04,6.6 67.31,5.33 L3.P$2
N$42
  Top 0.305: R12.2 55.88,19.3 60.96,19.3 R11.1
N$43
  Top 0.305: U$3.1 U$12.14
N$44
  Top 0.305: U$4.1 U$12.15
N$45
  Top 0.305: U$6.1 U$12.16
N$46  (via drill 0.51)
  Top 0.305: v58.67,10.16 IC4.4 | v59.44,14.73 60.96,16.26 R11.2 60.96,16.51 66.04,16.51 R10.1
  Bottom 0.305: v58.67,10.16 59.44,10.92 v59.44,14.73
N$47
  Top 0.305: U$7.1 U$12.17
N$48
  Top 0.305: U$8.1 U$12.18
N$49
  Top 0.305: U$9.1 U$12.19
N$50
  Top 0.305: U$12.20@0 U$10.1
N$52
  Bottom 0.61: U$12.IOREF U$13.1
SCL_3V3  (via drill 0.51)
  Top 0.305: Q3.1 46.35,43.81 R4.P$1 49.91,42.16 71.37,42.16 72.39,41.15 72.39,40.01 70.48,38.1 JP4.2 | U$12.SCL 21.34,73.66 40.64,73.66 45.72,68.58 v46.74,68.58
  Bottom 0.305: v46.74,68.58 48.26,67.06 48.26,52.32 46.74,50.8 46.74,45.34 R4.P$1
SCL_5V  (via drill 0.51)
  Top 0.305: v36.83,48.26 34.29,45.72 IC1.8 | X2.5 13.46,50.8 13.46,63.5 v30.48,63.5 | Q4.1 47.75,50.8 48.26,50.29 R6.P$1
  Bottom 0.305: 41.15,52.58 v36.83,48.26 | 41.15,52.58 44.45,52.58 Q4.1 | v30.48,63.5 32.51,63.5 41.15,54.86 41.15,52.58
SDA_3V3
  Top 0.305: Q1.1 46.99,35.56 R1.P$1 49.78,35.81 61.21,35.81 JP1.2
  Bottom 0.305: U$12.SDA 22.86,77.72 43.69,77.72 43.69,68.83 45.72,66.8 45.72,51.56 45.97,51.31 45.97,37.08 Q1.1
SDA_5V  (via drill 0.51)
  Top 0.305: IC1.7 34.29,40.89 39.37,40.89 40.64,42.16 42.93,42.16 Q2.1 R3.P$1 | X2.7 16.51,43.18 14.73,41.4 14.73,28.96 24.64,28.96 27.94,32.26 40.64,32.26 41.15,31.75 44.2,31.75 44.96,32.51 46.23,32.51 v48.01,30.73
  Bottom 0.305: v48.01,30.73 50.55,33.27 50.55,38.35 R3.P$1
SHDN
  Top 0.305: IC3.7@1 45.21,61.21 45.09,60.96 | X2.3 14.48,53.34 14.48,61.98 33.27,61.98 36.83,65.53 R9.P$1
  Bottom 0.305: IC3.7 40.64,69.85 Q5.3 36.83,67.31 R9.P$1
VIN  (via drill 0.51)
  Top 0.406: R9.P$2 38.61,54.1 45.09,54.1 IC3.2@1 45.09,55.88 | X2.8 21.59,46.99 22.61,48.26 v34.8,48.26 | 85.72,22.86 85.85,22.86 IC2.1@1 85.6,22.86 84.58,22.86 IC2.2@1 | IC2.1 L1.P$1 | 58.67,4.32 58.67,2.54 C15.1 | 58.67,4.32 IC4.6 | IC4.3 61.98,9.91 65.53,9.91 | 67.31,9.91 65.53,9.91 | 58.67,4.32 63.25,4.32 64.26,3.3 68.83,3.3 69.85,4.32 69.85,9.91 67.31,9.91 | 67.31,9.91 L3.P$1 | 65.53,9.91 65.53,8.64 L2.P$1 | IC2.5@1 81.92,14.61 | 84.45,22.99 IC2.2@1 | IC2.2@1 84.45,20.95
  Bottom 0.406: R9.P$2 34.8,53.85 v34.8,48.26 36.58,46.48 38.1,46.48 39.62,44.96 39.62,34.04 43.18,30.48 U$1.1 U$12.VIN 47.5,26.16 56.39,26.16 JP3.1 63.37,19.18 | C3.1 91.69,14.99 91.69,20.32 L1.P$1 | 80.01,14.61 85.09,19.68 IC2.2 | 80.01,14.61 IC2.5 | 63.37,19.18 67.31,15.24 67.31,14.61 | L3.P$1 67.31,14.61 | 67.31,14.61 80.01,14.61 | 63.5,19.3 63.37,19.18
XRF_SLEEP
  Top 0.305: U$12.7 JP11.1

### Text on the board
tNames: ICSP
bNames: http://github.com/stevemarple/FLC100_shield | FLC100 shield v1.0